# Altium schematic sheet ttl_logic_mech.SchDoc
size A
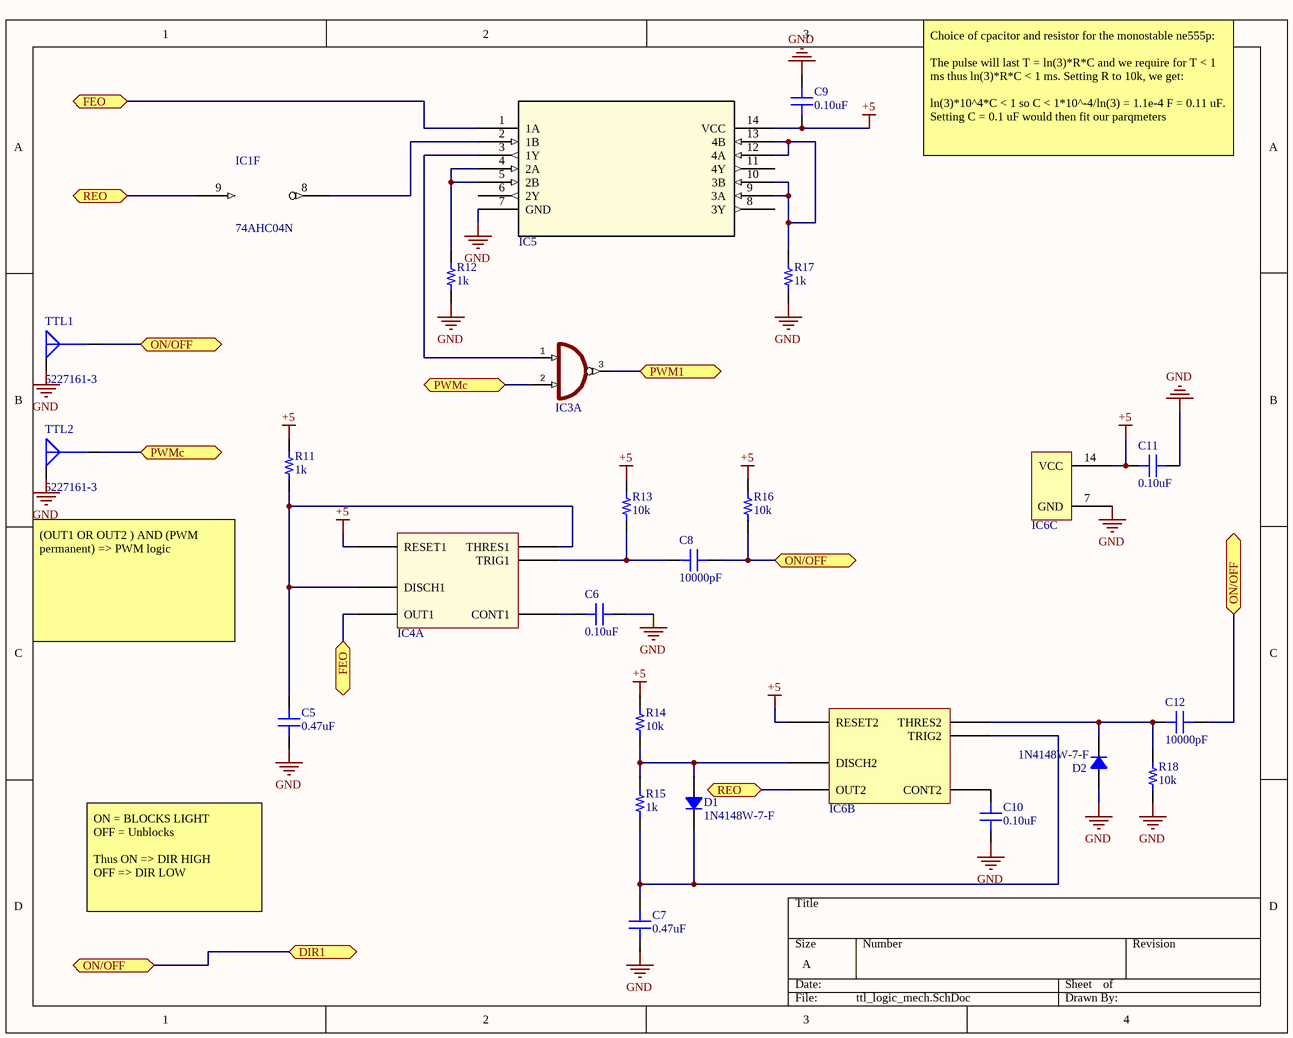
[diagram p0: ttl_logic_mech.SchDoc]

## Parts
C5  0.47uF  [CAP 0805/2012]
C6  0.10uF  [CAP 1206/3216 - 1.0MM]
C7  0.47uF  [CAP 0805/2012]
C8  10000pF  [CAP 0805/2012]
C9  0.10uF  [CAP 1206/3216 - 1.0MM]
C10  0.10uF  [CAP 1206/3216 - 1.0MM]
C11  0.10uF  [CAP 1206/3216 - 1.0MM]
C12  10000pF  [CAP 0805/2012]
D1  1N4148W-7-F  [SOD-123]
D2  1N4148W-7-F  [SOD-123]
IC1  74AHC04N  [DIL14]  (part F of 7)
IC3  (no value)  [Atmel SO-14 14S1]  (part A of 5)
IC4  NE556D  [Atmel SO-14 14S1]  (value not drawn)  (part A of 3)
IC5  SN74LS86ADR  [Atmel SO-14 14S1]  (value not drawn)
IC6  NE556P  [DIP14]  (value not drawn)  (parts B,C of 3)
R11  1k  [RES 1206/3216]
R12  1k  [RES 1206/3216]
R13  10k  [RES 1206/3216]
R14  10k  [RES 1206/3216]
R15  1k  [RES 1206/3216]
R16  10k  [RES 1206/3216]
R17  1k  [RES 1206/3216]
R18  10k  [RES 1206/3216]
TTL1  5227161-3  [5227161-3]
TTL2  5227161-3  [5227161-3]

## Ports
DIR1, FEO, ON/OFF, PWM1, PWMc, REO

## Nets
+5: C9.2 C11.2 IC4.4(RESET1) IC5.14(VCC) IC6.10(RESET2) IC6.14(VCC) R11.2 R13.2 R14.2 R16.2
GND: C5.1 C6.1 C7.1 C9.1 C10.2 C11.1 D2.1 IC5.7(GND) IC6.7(GND) R12.1 R17.1 R18.1 TTL1.G TTL2.G
DIR1: C8.2 C12.2 R16.1 TTL1.S ; port ON/OFF, port DIR1
FEO: IC4.5(OUT1) IC5.1(1A) ; port FEO
PWM1: IC3.3(O) ; port PWM1
PWMc: IC3.2(I1) TTL2.S ; port PWMc
REO: IC1.9(I0) IC6.9(OUT2) ; port REO
NetC5_2: C5.2 IC4.1(DISCH1) IC4.2(THRES1) R11.1
NetC6_2: C6.2 IC4.3(CONT1)
NetC7_2: C7.2 D1.2 IC6.8(TRIG2) R15.1
NetC8_1: C8.1 IC4.6(TRIG1) R13.1
NetC10_1: C10.1 IC6.11(CONT2)
NetC12_1: C12.1 D2.2 IC6.12(THRES2) R18.2
NetD1_1: D1.1 IC6.13(DISCH2) R14.1 R15.2
NetIC1_8: IC1.8(O0) IC5.2(1B)
NetIC3_1: IC3.1(I0) IC5.3(1Y)
NetIC5_4: IC5.4(2A) IC5.5(2B) R12.2
NetIC5_9: IC5.9(3A) IC5.10(3B) IC5.12(4A) IC5.13(4B) R17.2

Not connected (* = marked no-connect by the designer): IC5 6(2Y) 8(3Y) 11(4Y)

## Notes on the sheet
- Choice of cpacitor and resistor for the monostable ne555p:
  The pulse will last T = ln(3)*R*C and we require for T < 1 ms thus ln(3)*R*C < 1 ms. Setting R to 10k, we get:
  ln(3)*10^4*C < 1 so C < 1*10^-4/ln(3) = 1.1e-4 F = 0.11 uF. Setting C = 0.1 uF would then fit our parqmeters
- (OUT1 OR OUT2 ) AND (PWM permanent) => PWM logic
- ON = BLOCKS LIGHT
  OFF = Unblocks
  Thus ON => DIR HIGH
  OFF => DIR LOW

## Library data of the parts
C5 C7 = C0805C474J4RACTU: CAP CER 0.47UF 16V X7R 0805; Manufacturer: Kemet; TemperatureRange: -55C ~ 125C; Tolerance: 5%; Value: 0.47uF; Part Number: C0805C474J4RACTU; PartId: 6142; Supplier 1: Digi-Key; Supplier Part Number 1: 399-8097-2-ND; ComponentLink1Description: Datasheet; ComponentLink1URL: http://www.kemet.com/docfinder?Partnumber=C0805C474J4RACTU; ComponentLink2Description: Digi-Key listing; ComponentLink2URL: http://digikey.com/product-detail/en/C0805C474J4RACTU/399-8097-2-ND/2212878; TemperatureCoefficient: X7R; Voltage: 16V; Price: 0.2869; Type: -; Device Package: 0805 (2012 Metric)
C6 C9-C11 = C1206C104K4RACTU: CAP CER 0.1UF 16V X7R 1206; Manufacturer: Kemet; TemperatureRange: -55C ~ 125C; Tolerance: 10%; Value: 0.10uF; Part Number: C1206C104K4RACTU; PartId: 17000; Supplier 1: Digi-Key; Supplier Part Number 1: 399-9305-2-ND; ComponentLink1Description: Datasheet; ComponentLink1URL: http://www.kemet.com/docfinder?Partnumber=C1206C104K4RACTU; ComponentLink2Description: Digi-Key Listing; ComponentLink2URL: https://www.digikey.com/product-detail/en/kemet/C1206C104K4RACTU/399-9305-2-ND/2215078; TemperatureCoefficient: X7R; Voltage: 16V; Price: 0.0211; Device Package: 1206 (3216 Metric)
C8 C12 = C0805C103J3RACTU: CAP CER 10000PF 25V X7R 0805; Manufacturer: Kemet; TemperatureRange: -55C ~ 125C; Tolerance: 5%; Value: 10000pF; Part Number: C0805C103J3RACTU; PartId: 6072; Supplier 1: Digi-Key; Supplier Part Number 1: 399-7991-2-ND; ComponentLink1Description: Datasheet; ComponentLink1URL: http://www.kemet.com/docfinder?Partnumber=C0805C103J3RACTU; ComponentLink2Description: Digi-Key listing; ComponentLink2URL: http://digikey.com/product-detail/en/C0805C103J3RACTU/399-7991-2-ND/2211707; TemperatureCoefficient: X7R; Voltage: 25V; Price: 0.1008; Type: -; Device Package: 0805 (2012 Metric)
D1 D2 = 1N4148W-7-F: DIODE GEN PURP 100V 300MA SOD123; Manufacturer: Diodes Incorporated; Type: Standard; Current Reverse Leakage @ Vr: 1uA @ 75V; Reverse Recovery Time (trr): 4ns; Current Rectified: 300mA (DC); Voltage Forward (Vf): 1.25V @ 150mA; Part Number: 1N4148W-7-F; PartId: 14588; Supplier 1: Digi-Key; Supplier Part Number 1: 1N4148W-FDITR-ND; ComponentLink1Description: Datasheet; ComponentLink1URL: http://www.diodes.com/_files/datasheets/ds30086.pdf; ComponentLink2Description: Digi-Key Listing; ComponentLink2URL: https://www.digikey.com/product-detail/en/diodes-incorporated/1N4148W-7-F/1N4148W-FDITR-ND/814371; Junction Operating Temperature: -65C ~ 150C; Price: 0.028; Device Package: SOD-123; Voltage DC Reverse (Vr): 100V
IC3 = SN74AC08D: IC GATE AND 4CH 2-INP 14-SOIC; Manufacturer: Texas Instruments; Supply Voltage: 2 V ~ 6 V; Number of Circuits: 4; Number of Entries: 2; Low Logic Level: 0.9 V ~ 1.65 V; High Logic Level: 2.1 V ~ 3.85 V; Propagation Delay: 7.5ns @ 5V, 50pF; Part Number: SN74AC08D; PartID: 3; Supplier 1: Farnell; Supplier Part Number 1: 9590226; ComponentLink1Description: Datasheet; ComponentLink1URL: http://www.ti.com/lit/ds/symlink/sn74ac08.pdf; ComponentLink2Description: Farnell Listing; ComponentLink2URL: http://fr.farnell.com/texas-instruments/sn74ac08d/circuit-logique-2-entreesquad/dp/9590226; Series: 74AC; Logic Type: AND
IC4 = NE556D: 2 ne555 timers in one soic 14; Manufacturer: Texas Instruments; PartId: 4; Value: NE556D; Part Number: NE556D
IC5 = SN74LS86ADR: IC GATE XOR 4CH 2-INP 14-SOIC; Manufacturer: Texas Instruments; Built_By: EMA_UL_Team; C: Copyright (C) 2015 Accelerated Designs. All rights reserved; Vendor: Vendor; Manufacturer_Part_Number: SN74LS86ADR; Value: SN74LS86ADR; Type: Type; RefDes: RefDes; Part Number: SN74LS86ADR; PartId: 5
IC6 = NE556P: Manufacturer: Texas Instruments; PartId: 3; Value: NE556P; Part Number: NE556P
R11 R12 R15 R17 = ERA-8ARW102V: RES SMD 1K OHM 0.05% 1/4W 1206; Manufacturer: Panasonic Electronic Components; TemperatureRange: -55C ~ 155C; TemperatureCoefficient: 10ppm/C; PowerRating: 0.25W, 1/4W; Value: 1k; Part Number: ERA-8ARW102V; PartId: 3638; Supplier 1: Digi-Key; Supplier Part Number 1: P1KCTTR-ND; ComponentLink1Description: Datasheet; ComponentLink1URL: http://industrial.panasonic.com/lecs/www-data/pdf/AOA0000/AOA0000CE26.pdf; ComponentLink2Description: Digi-Key listing; ComponentLink2URL: http://digikey.com/product-detail/en/ERA-8ARW102V/P1KCTTR-ND/5141111; Tolerance: 0.05%; Price: 0.9266; Type: Thin Film; Device Package: 1206 (3216 Metric)
R13 R14 R16 R18 = ERJ-8GEYJ103V: RES SMD 10K OHM 5% 1/4W 1206; Manufacturer: Panasonic Electronic Components; TemperatureRange: -55C ~ 155C; TemperatureCoefficient: 200ppm/C; PowerRating: 0.25W, 1/4W; Value: 10k; Part Number: ERJ-8GEYJ103V; PartId: 11816; Supplier 1: Digi-Key; Supplier Part Number 1: P10KETR-ND; ComponentLink1Description: Datasheet; ComponentLink1URL: http://industrial.panasonic.com/www-cgi/jvcr13pz.cgi?E+PZ+3+AOA0001+ERJ8GEYJ103V+7+WW; ComponentLink2Description: Digi-Key Listing; ComponentLink2URL: https://www.digikey.com/product-detail/en/panasonic-electronic-components/ERJ-8GEYJ103V/P10KETR-ND/12063; Tolerance: 5%; Price: 0.0045; Device Package: 1206 (3216 Metric)
TTL1 TTL2 = 5227161-3: CONN BNC JACK R/A 50 OHM PCB; Manufacturer: TE Connectivity AMP Connectors; Part Number: 5227161-3; PartId: 16437; Supplier 1: Farnell; Supplier Part Number 1: 1831703; ComponentLink1Description: Datasheet; ComponentLink1URL: http://www.farnell.com/datasheets/218041.pdf?_ga=2.34157409.1597433047.1513002155-490126870.1506116288; ComponentLink2Description: Farnell Listing; ComponentLink2URL: http://fr.farnell.com/amp-from-te-connectivity/5227161-3/fiche-femelle-bnc-coude-50ohm/dp/1831703?ost=5227161-3&iscrfnonsku=false&ddkey=http%3Afr-FR%2FElement14_France%2Fsearch